# Altium schematic sheet NetTieSingleAndDiff.SchDoc
size A4; CompanyName: Technische Hochschule Nürnberg Georg Simon Ohm; Address1: Fürther Straße 250; Address2: 90429 Nürnberg; Address3: GERMANY; DocumentNumber: 11; SheetNumber: 11; SheetTotal: 16; CompanyName2: Institut ELSYS
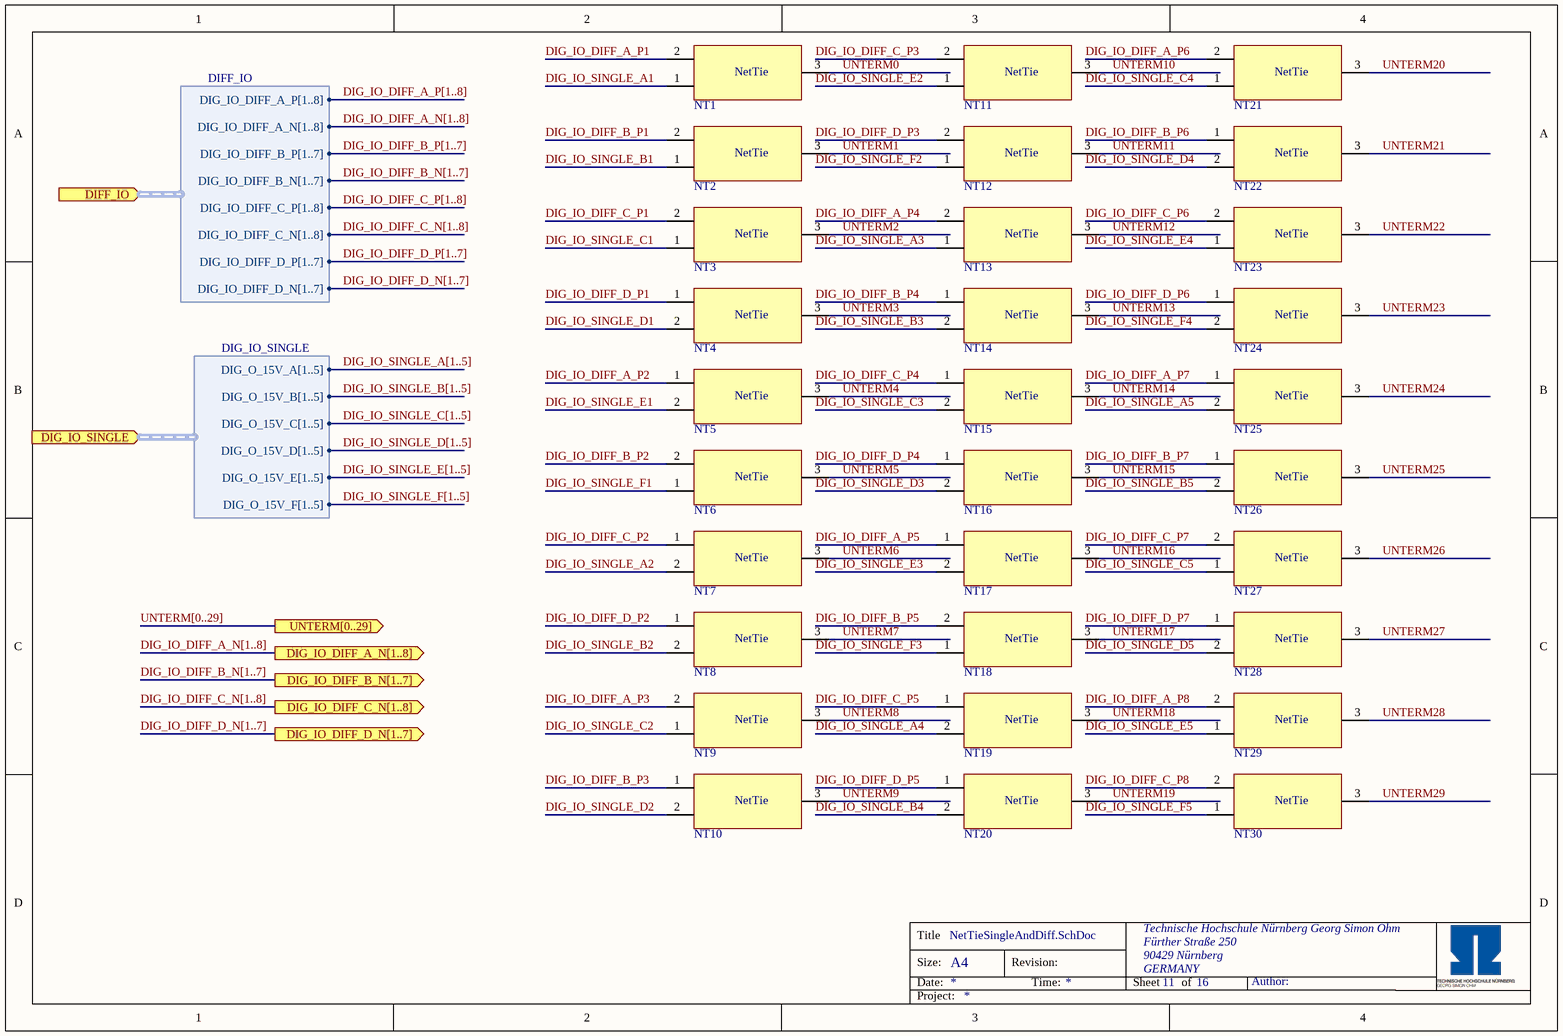
[diagram p0: NetTieSingleAndDiff.SchDoc]

## Parts
NT1  Net Tie 2 to 1  [2_to_1_NETTIE_TH_170u]  (value not drawn)  (net tie, no BOM)
NT2  Net Tie 2 to 1  [2_to_1_NETTIE_TH_170u]  (value not drawn)  (net tie, no BOM)
NT3  Net Tie 2 to 1  [2_to_1_NETTIE_TH_170u]  (value not drawn)  (net tie, no BOM)
NT4  Net Tie 2 to 1  [2_to_1_NETTIE_TH_170u]  (value not drawn)  (net tie, no BOM)
NT5  Net Tie 2 to 1  [2_to_1_NETTIE_TH_170u]  (value not drawn)  (net tie, no BOM)
NT6  Net Tie 2 to 1  [2_to_1_NETTIE_TH_170u]  (value not drawn)  (net tie, no BOM)
NT7  Net Tie 2 to 1  [2_to_1_NETTIE_TH_170u]  (value not drawn)  (net tie, no BOM)
NT8  Net Tie 2 to 1  [2_to_1_NETTIE_TH_170u]  (value not drawn)  (net tie, no BOM)
NT9  Net Tie 2 to 1  [2_to_1_NETTIE_TH_170u]  (value not drawn)  (net tie, no BOM)
NT10  Net Tie 2 to 1  [2_to_1_NETTIE_TH_170u]  (value not drawn)  (net tie, no BOM)
NT11  Net Tie 2 to 1  [2_to_1_NETTIE_TH_170u]  (value not drawn)  (net tie, no BOM)
NT12  Net Tie 2 to 1  [2_to_1_NETTIE_TH_170u]  (value not drawn)  (net tie, no BOM)
NT13  Net Tie 2 to 1  [2_to_1_NETTIE_TH_170u]  (value not drawn)  (net tie, no BOM)
NT14  Net Tie 2 to 1  [2_to_1_NETTIE_TH_170u]  (value not drawn)  (net tie, no BOM)
NT15  Net Tie 2 to 1  [2_to_1_NETTIE_TH_170u]  (value not drawn)  (net tie, no BOM)
NT16  Net Tie 2 to 1  [2_to_1_NETTIE_TH_170u]  (value not drawn)  (net tie, no BOM)
NT17  Net Tie 2 to 1  [2_to_1_NETTIE_TH_170u]  (value not drawn)  (net tie, no BOM)
NT18  Net Tie 2 to 1  [2_to_1_NETTIE_TH_170u]  (value not drawn)  (net tie, no BOM)
NT19  Net Tie 2 to 1  [2_to_1_NETTIE_TH_170u]  (value not drawn)  (net tie, no BOM)
NT20  Net Tie 2 to 1  [2_to_1_NETTIE_TH_170u]  (value not drawn)  (net tie, no BOM)
NT21  Net Tie 2 to 1  [2_to_1_NETTIE_TH_170u]  (value not drawn)  (net tie, no BOM)
NT22  Net Tie 2 to 1  [2_to_1_NETTIE_TH_170u]  (value not drawn)  (net tie, no BOM)
NT23  Net Tie 2 to 1  [2_to_1_NETTIE_TH_170u]  (value not drawn)  (net tie, no BOM)
NT24  Net Tie 2 to 1  [2_to_1_NETTIE_TH_170u]  (value not drawn)  (net tie, no BOM)
NT25  Net Tie 2 to 1  [2_to_1_NETTIE_TH_170u]  (value not drawn)  (net tie, no BOM)
NT26  Net Tie 2 to 1  [2_to_1_NETTIE_TH_170u]  (value not drawn)  (net tie, no BOM)
NT27  Net Tie 2 to 1  [2_to_1_NETTIE_TH_170u]  (value not drawn)  (net tie, no BOM)
NT28  Net Tie 2 to 1  [2_to_1_NETTIE_TH_170u]  (value not drawn)  (net tie, no BOM)
NT29  Net Tie 2 to 1  [2_to_1_NETTIE_TH_170u]  (value not drawn)  (net tie, no BOM)
NT30  Net Tie 2 to 1  [2_to_1_NETTIE_TH_170u]  (value not drawn)  (net tie, no BOM)

## Ports
DIFF_IO (in, harness DIFF_IO), DIG_IO_DIFF_A_N[1..8] (out), DIG_IO_DIFF_B_N[1..7] (out), DIG_IO_DIFF_C_N[1..8] (out), DIG_IO_DIFF_D_N[1..7] (out), DIG_IO_SINGLE (in, harness DIG_IO_SINGLE), UNTERM[0..29] (out)

## Harnesses
DIFF_IO: DIG_IO_DIFF_A_N[1..8], DIG_IO_DIFF_A_P[1..8], DIG_IO_DIFF_B_N[1..7], DIG_IO_DIFF_B_P[1..7], DIG_IO_DIFF_C_N[1..8], DIG_IO_DIFF_C_P[1..8], DIG_IO_DIFF_D_N[1..7], DIG_IO_DIFF_D_P[1..7]
DIG_IO_SINGLE: DIG_O_15V_A[1..5], DIG_O_15V_B[1..5], DIG_O_15V_C[1..5], DIG_O_15V_D[1..5], DIG_O_15V_E[1..5], DIG_O_15V_F[1..5]

## Nets
DIG_IO_DIFF_A_P1: NT1.2
DIG_IO_DIFF_A_P2: NT5.1
DIG_IO_DIFF_A_P3: NT9.2
DIG_IO_DIFF_A_P4: NT13.2
DIG_IO_DIFF_A_P5: NT17.1
DIG_IO_DIFF_A_P6: NT21.2
DIG_IO_DIFF_A_P7: NT25.1
DIG_IO_DIFF_A_P8: NT29.2
DIG_IO_DIFF_B_P1: NT2.2
DIG_IO_DIFF_B_P2: NT6.2
DIG_IO_DIFF_B_P3: NT10.1
DIG_IO_DIFF_B_P4: NT14.1
DIG_IO_DIFF_B_P5: NT18.2
DIG_IO_DIFF_B_P6: NT22.1
DIG_IO_DIFF_B_P7: NT26.1
DIG_IO_DIFF_C_P1: NT3.2
DIG_IO_DIFF_C_P2: NT7.1
DIG_IO_DIFF_C_P3: NT11.2
DIG_IO_DIFF_C_P4: NT15.1
DIG_IO_DIFF_C_P5: NT19.1
DIG_IO_DIFF_C_P6: NT23.2
DIG_IO_DIFF_C_P7: NT27.2
DIG_IO_DIFF_C_P8: NT30.2
DIG_IO_DIFF_D_P1: NT4.1
DIG_IO_DIFF_D_P2: NT8.1
DIG_IO_DIFF_D_P3: NT12.2
DIG_IO_DIFF_D_P4: NT16.1
DIG_IO_DIFF_D_P5: NT20.1
DIG_IO_DIFF_D_P6: NT24.1
DIG_IO_DIFF_D_P7: NT28.1
DIG_IO_SINGLE_A1: NT1.1
DIG_IO_SINGLE_A2: NT7.2
DIG_IO_SINGLE_A3: NT13.1
DIG_IO_SINGLE_A4: NT19.2
DIG_IO_SINGLE_A5: NT25.2
DIG_IO_SINGLE_B1: NT2.1
DIG_IO_SINGLE_B2: NT8.2
DIG_IO_SINGLE_B3: NT14.2
DIG_IO_SINGLE_B4: NT20.2
DIG_IO_SINGLE_B5: NT26.2
DIG_IO_SINGLE_C1: NT3.1
DIG_IO_SINGLE_C2: NT9.1
DIG_IO_SINGLE_C3: NT15.2
DIG_IO_SINGLE_C4: NT21.1
DIG_IO_SINGLE_C5: NT27.1
DIG_IO_SINGLE_D1: NT4.2
DIG_IO_SINGLE_D2: NT10.2
DIG_IO_SINGLE_D3: NT16.2
DIG_IO_SINGLE_D4: NT22.2
DIG_IO_SINGLE_D5: NT28.2
DIG_IO_SINGLE_E1: NT5.2
DIG_IO_SINGLE_E2: NT11.1
DIG_IO_SINGLE_E3: NT17.2
DIG_IO_SINGLE_E4: NT23.1
DIG_IO_SINGLE_E5: NT29.1
DIG_IO_SINGLE_F1: NT6.1
DIG_IO_SINGLE_F2: NT12.1
DIG_IO_SINGLE_F3: NT18.1
DIG_IO_SINGLE_F4: NT24.2
DIG_IO_SINGLE_F5: NT30.1
UNTERM0: NT1.3
UNTERM1: NT2.3
UNTERM2: NT3.3
UNTERM3: NT4.3
UNTERM4: NT5.3
UNTERM5: NT6.3
UNTERM6: NT7.3
UNTERM7: NT8.3
UNTERM8: NT9.3
UNTERM9: NT10.3
UNTERM10: NT11.3
UNTERM11: NT12.3
UNTERM12: NT13.3
UNTERM13: NT14.3
UNTERM14: NT15.3
UNTERM15: NT16.3
UNTERM16: NT17.3
UNTERM17: NT18.3
UNTERM18: NT19.3
UNTERM19: NT20.3
UNTERM20: NT21.3
UNTERM21: NT22.3
UNTERM22: NT23.3
UNTERM23: NT24.3
UNTERM24: NT25.3
UNTERM25: NT26.3
UNTERM26: NT27.3
UNTERM27: NT28.3
UNTERM28: NT29.3
UNTERM29: NT30.3

## Buses and harness runs
bus DIG_IO_DIFF_A_N[1..8]
bus DIG_IO_DIFF_A_N[1..8] = port DIG_IO_DIFF_A_N[1..8]
bus DIG_IO_DIFF_A_P[1..8]
bus DIG_IO_DIFF_B_N[1..7]
bus DIG_IO_DIFF_B_N[1..7] = port DIG_IO_DIFF_B_N[1..7]
bus DIG_IO_DIFF_B_P[1..7]
bus DIG_IO_DIFF_C_N[1..8]
bus DIG_IO_DIFF_C_N[1..8] = port DIG_IO_DIFF_C_N[1..8]
bus DIG_IO_DIFF_C_P[1..8]
bus DIG_IO_DIFF_D_N[1..7]
bus DIG_IO_DIFF_D_N[1..7] = port DIG_IO_DIFF_D_N[1..7]
bus DIG_IO_DIFF_D_P[1..7]
bus DIG_IO_SINGLE_A[1..5]
bus DIG_IO_SINGLE_B[1..5]
bus DIG_IO_SINGLE_C[1..5]
bus DIG_IO_SINGLE_D[1..5]
bus DIG_IO_SINGLE_E[1..5]
bus DIG_IO_SINGLE_F[1..5]
bus UNTERM[0..29] = port UNTERM[0..29]

## Notes on the sheet
- Title
- Size:
- Date:
- A4
- Revision:
- Time:
- Sheet
- of
- Author:
- Project:
- (in symbol Net Tie 2 to 1) NetTie

## Library data of the parts
NT1-NT30 = Net Tie 2 to 1: Net Tie 2 to 1. Joints two nets without producing a DRC error; PartID: 1; Created On: 26.02.2021 18:37:51; Component Type: Net Tie 2 to 1; Last Updated: 26.02.2021 18:44:55; Type: Net Tie (No BOM); Created by: T. Wendt; Live Cycle Status: 1